# Altium schematic sheet Microcontroller.SchDoc
size A4; SheetNumber: 2; SheetTotal: 3
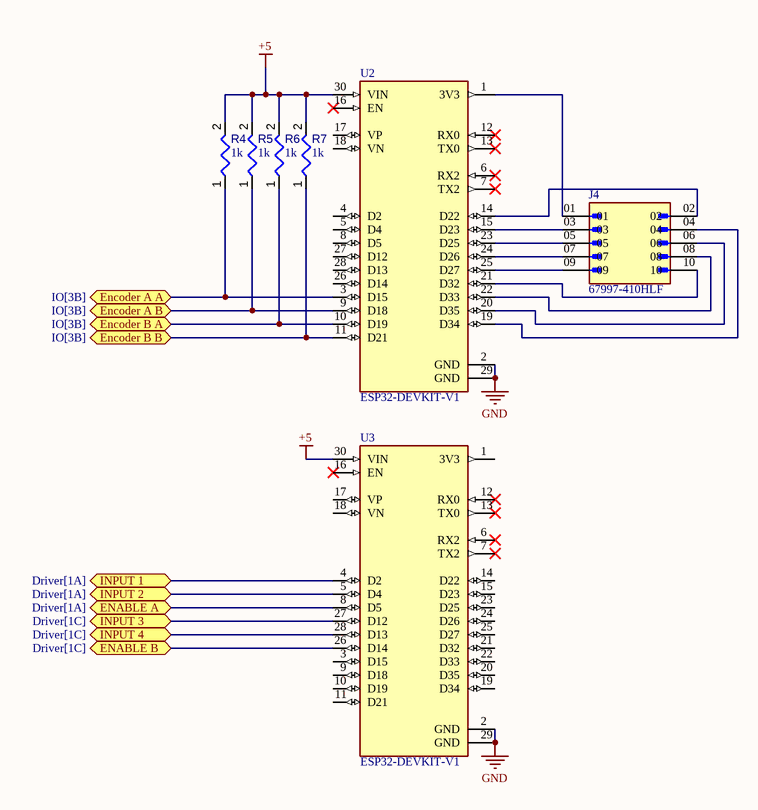
[diagram p0: Microcontroller.SchDoc]

## Parts
J4  67997-410HLF  [AMPHENOL_67997-410HLF]
R4  value 1k  [RESC1608X55X25ML10T15]  (hidden comment: Resistor 1k +/-1% 0603 100 mW)
R5  value 1k  [RESC1608X55X25ML10T15]  (hidden comment: Resistor 1k +/-1% 0603 100 mW)
R6  value 1k  [RESC1608X55X25ML10T15]  (hidden comment: Resistor 1k +/-1% 0603 100 mW)
R7  value 1k  [RESC1608X55X25ML10T15]  (hidden comment: Resistor 1k +/-1% 0603 100 mW)
U2  ESP32-DEVKIT-V1  [MODULE_ESP32_DEVKIT_V1]
U3  ESP32-DEVKIT-V1  [MODULE_ESP32_DEVKIT_V1]

## Ports
ENABLE A (bidir, see Driver[1A]), ENABLE B (bidir, see Driver[1C]), Encoder A A (bidir, see IO[3B]), Encoder A B (bidir, see IO[3B]), Encoder B A (bidir, see IO[3B]), Encoder B B (bidir, see IO[3B]), INPUT 1 (bidir, see Driver[1A]), INPUT 2 (bidir, see Driver[1A]), INPUT 3 (bidir, see Driver[1C]), INPUT 4 (bidir, see Driver[1C])

## Nets
+5: R4.2 R5.2 R6.2 R7.2 U2.30(VIN) U3.30(VIN)
GND: U2.2(GND) U2.29(GND) U3.2(GND) U3.29(GND)
ENABLE A: U3.8(D5) ; port ENABLE A
ENABLE B: U3.26(D14) ; port ENABLE B
Encoder A A: R4.1 U2.3(D15) ; port Encoder A A
Encoder A B: R5.1 U2.9(D18) ; port Encoder A B
Encoder B A: R6.1 U2.10(D19) ; port Encoder B A
Encoder B B: R7.1 U2.11(D21) ; port Encoder B B
INPUT 1: U3.4(D2) ; port INPUT 1
INPUT 2: U3.5(D4) ; port INPUT 2
INPUT 3: U3.27(D12) ; port INPUT 3
INPUT 4: U3.28(D13) ; port INPUT 4
NetJ4_01: J4.01 U2.1(3V3)
NetJ4_02: J4.02 U2.14(D22)
NetJ4_03: J4.03 U2.15(D23)
NetJ4_04: J4.04 U2.19(D34)
NetJ4_05: J4.05 U2.23(D25)
NetJ4_06: J4.06 U2.20(D35)
NetJ4_07: J4.07 U2.24(D26)
NetJ4_08: J4.08 U2.22(D33)
NetJ4_09: J4.09 U2.25(D27)
NetJ4_10: J4.10 U2.21(D32)

Not connected (* = marked no-connect by the designer): U2 4(D2) 5(D4) 6(RX2)* 7(TX2)* 8(D5) 12(RX0)* 13(TX0)* 16(EN)* 17(VP) 18(VN) 26(D14) 27(D12) 28(D13); U3 1(3V3) 3(D15) 6(RX2)* 7(TX2)* 9(D18) 10(D19) 11(D21) 12(RX0)* 13(TX0)* 14(D22) 15(D23) 16(EN)* 17(VP) 18(VN) 19(D34) 20(D35) 21(D32) 22(D33) 23(D25) 24(D26) 25(D27)

## Library data of the parts
J4 = 67997-410HLF: BergStikÂ®, Board to Board connector, Unshrouded vertical header, Through Hole, Double Row, 10 Positions, 2.54 mm (0.100in) Pitch; MF: Amphenol ICC; Value: *; MP: 67997-410HLF; Package: None; SnapEDA_Link: https://www.snapeda.com/parts/67997-410HLF/Amphenol+FCI/view-part/?ref=snap; Check_prices: https://www.snapeda.com/parts/67997-410HLF/Amphenol+FCI/view-part/?ref=eda; Digi-Key_Part_Number: 609-3243-ND; Purchase-URL: https://pricing.snapeda.com/search/part/67997-410HLF/?ref=eda
R4-R7 = CMP-009-00014-5: Chip Resistor, 1 KOhm, +/-1%, 0.1 W, -55 to 155 degC, 0603 (1608 Metric); Voltage Rating: 50V; Power: 100mW; Tolerance: 1%; Mounting Technology: SM; Pins: 2; Case/Package: 0603; Min Operating Temperature: -55°C; RoHS Compliant: True; Max Operating Temperature: 155°C
U2 U3 = ESP32-DEVKIT-V1: Dual core, Wi-Fi: 2.4 GHz up to 150 Mbits/s,BLE (Bluetooth Low Energy) and legacy Bluetooth, 32 bits, Up to 240 MHz; MF: Do it; Price: None; Availability: Not in stock; Package: None; MP: ESP32-DEVKIT-V1; Value: *; SnapEDA_Link: https://www.snapeda.com/parts/ESP32-DEVKIT-V1/Do+it/view-part/?ref=snap; Check_prices: https://www.snapeda.com/parts/ESP32-DEVKIT-V1/Do+it/view-part/?ref=eda